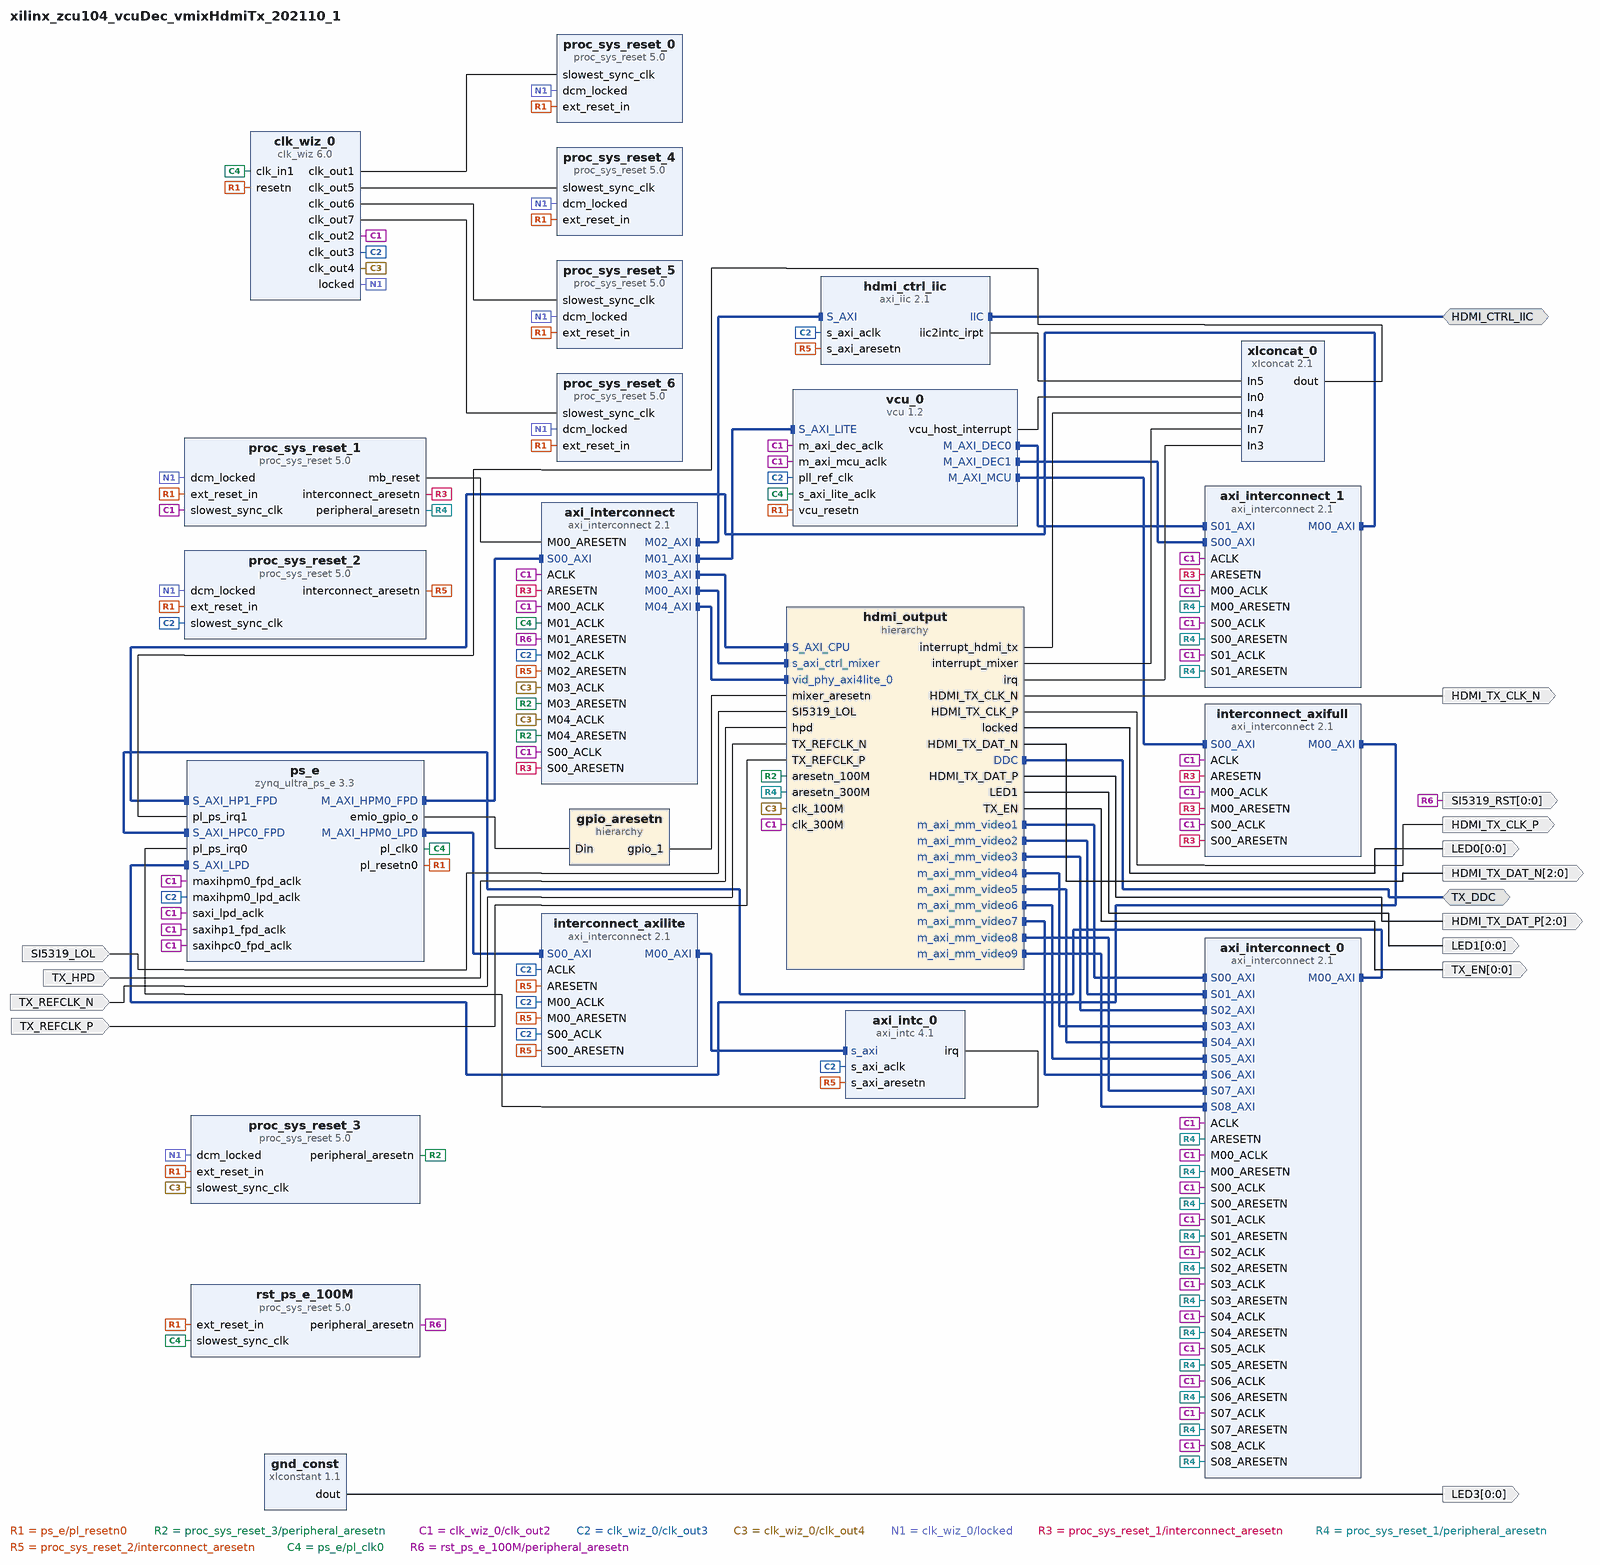
[diagram p0: block diagram of the top level]
# Vivado block design xilinx_zcu104_vcuDec_vmixHdmiTx_202110_1, xczu7ev-ffvc1156-2-e, Vivado 2021.1.1
create_bd_design xilinx_zcu104_vcuDec_vmixHdmiTx_202110_1

create_bd_intf_port -mode Master -vlnv xilinx.com:interface:iic_rtl:1.0 HDMI_CTRL_IIC
create_bd_intf_port -mode Master -vlnv xilinx.com:interface:iic_rtl:1.0 TX_DDC
create_bd_port -dir O HDMI_TX_CLK_N
create_bd_port -dir O HDMI_TX_CLK_P
create_bd_port -dir O -from 2 -to 0 HDMI_TX_DAT_N
create_bd_port -dir O -from 2 -to 0 HDMI_TX_DAT_P
create_bd_port -dir O -from 0 -to 0 LED0
create_bd_port -dir O -from 0 -to 0 LED1
create_bd_port -dir O -from 0 -to 0 LED3
create_bd_port -dir I SI5319_LOL
create_bd_port -dir O -from 0 -to 0 SI5319_RST
create_bd_port -dir O -from 0 -to 0 TX_EN
create_bd_port -dir I TX_HPD
create_bd_port -dir I TX_REFCLK_N
create_bd_port -dir I TX_REFCLK_P

create_bd_cell -type ip -vlnv xilinx.com:ip:axi_intc:4.1 axi_intc_0
set_property -dict {CONFIG.C_IRQ_CONNECTION 1 CONFIG.C_IRQ_IS_LEVEL 1} [get_bd_cells axi_intc_0]
create_bd_cell -type ip -vlnv xilinx.com:ip:axi_interconnect:2.1 axi_interconnect
set_property -dict {CONFIG.M03_HAS_REGSLICE 3 CONFIG.NUM_MI 5} [get_bd_cells axi_interconnect]
create_bd_cell -type ip -vlnv xilinx.com:ip:axi_interconnect:2.1 axi_interconnect_0
set_property -dict {CONFIG.NUM_MI 1 CONFIG.NUM_SI 9} [get_bd_cells axi_interconnect_0]
create_bd_cell -type ip -vlnv xilinx.com:ip:axi_interconnect:2.1 axi_interconnect_1
set_property -dict [list \
  CONFIG.M00_HAS_REGSLICE 1 \
  CONFIG.NUM_MI 1 \
  CONFIG.NUM_SI 2 \
  CONFIG.S00_HAS_DATA_FIFO 0 \
  CONFIG.S00_HAS_REGSLICE 1 \
  CONFIG.S01_HAS_DATA_FIFO 0 \
  CONFIG.S01_HAS_REGSLICE 1 \
  CONFIG.STRATEGY 0 \
] [get_bd_cells axi_interconnect_1]
create_bd_cell -type ip -vlnv xilinx.com:ip:clk_wiz:6.0 clk_wiz_0
set_property -dict [list \
  CONFIG.CLKIN1_JITTER_PS 100.01 \
  CONFIG.CLKOUT1_JITTER 107.567 \
  CONFIG.CLKOUT1_PHASE_ERROR 87.180 \
  CONFIG.CLKOUT1_REQUESTED_OUT_FREQ 150 \
  CONFIG.CLKOUT2_JITTER 94.862 \
  CONFIG.CLKOUT2_PHASE_ERROR 87.180 \
  CONFIG.CLKOUT2_REQUESTED_OUT_FREQ 300 \
  CONFIG.CLKOUT2_USED true \
  CONFIG.CLKOUT3_JITTER 144.570 \
  CONFIG.CLKOUT3_PHASE_ERROR 87.180 \
  CONFIG.CLKOUT3_REQUESTED_OUT_FREQ 33.33 \
  CONFIG.CLKOUT3_USED true \
  CONFIG.CLKOUT4_JITTER 115.831 \
  CONFIG.CLKOUT4_PHASE_ERROR 87.180 \
  CONFIG.CLKOUT4_REQUESTED_OUT_FREQ 100.000 \
  CONFIG.CLKOUT4_USED true \
  CONFIG.CLKOUT5_JITTER 102.086 \
  CONFIG.CLKOUT5_PHASE_ERROR 87.180 \
  CONFIG.CLKOUT5_REQUESTED_OUT_FREQ 200.000 \
  CONFIG.CLKOUT5_USED true \
  CONFIG.CLKOUT6_JITTER 90.074 \
  CONFIG.CLKOUT6_PHASE_ERROR 87.180 \
  CONFIG.CLKOUT6_REQUESTED_OUT_FREQ 400.000 \
  CONFIG.CLKOUT6_USED true \
  CONFIG.CLKOUT7_JITTER 83.768 \
  CONFIG.CLKOUT7_PHASE_ERROR 87.180 \
  CONFIG.CLKOUT7_REQUESTED_OUT_FREQ 600.000 \
  CONFIG.CLKOUT7_USED true \
  CONFIG.MMCM_CLKFBOUT_MULT_F 12.000 \
  CONFIG.MMCM_CLKIN1_PERIOD 10.000 \
  CONFIG.MMCM_CLKOUT0_DIVIDE_F 8.000 \
  CONFIG.MMCM_CLKOUT1_DIVIDE 4 \
  CONFIG.MMCM_CLKOUT2_DIVIDE 36 \
  CONFIG.MMCM_CLKOUT3_DIVIDE 12 \
  CONFIG.MMCM_CLKOUT4_DIVIDE 6 \
  CONFIG.MMCM_CLKOUT5_DIVIDE 3 \
  CONFIG.MMCM_CLKOUT6_DIVIDE 2 \
  CONFIG.MMCM_DIVCLK_DIVIDE 1 \
  CONFIG.NUM_OUT_CLKS 7 \
  CONFIG.RESET_PORT resetn \
  CONFIG.RESET_TYPE ACTIVE_LOW \
] [get_bd_cells clk_wiz_0]
create_bd_cell -type ip -vlnv xilinx.com:ip:xlconstant:1.1 gnd_const
set_property -dict {CONFIG.CONST_VAL 0} [get_bd_cells gnd_const]
create_bd_cell -type hier gpio_aresetn
create_bd_cell -type ip -vlnv xilinx.com:ip:axi_iic:2.1 hdmi_ctrl_iic
set_property -dict {CONFIG.IIC_BOARD_INTERFACE Custom CONFIG.USE_BOARD_FLOW true} [get_bd_cells hdmi_ctrl_iic]
create_bd_cell -type hier hdmi_output
create_bd_cell -type ip -vlnv xilinx.com:ip:axi_interconnect:2.1 interconnect_axifull
set_property -dict {CONFIG.NUM_MI 1 CONFIG.NUM_SI 1} [get_bd_cells interconnect_axifull]
create_bd_cell -type ip -vlnv xilinx.com:ip:axi_interconnect:2.1 interconnect_axilite
set_property -dict {CONFIG.NUM_MI 1} [get_bd_cells interconnect_axilite]
create_bd_cell -type ip -vlnv xilinx.com:ip:proc_sys_reset:5.0 proc_sys_reset_0
create_bd_cell -type ip -vlnv xilinx.com:ip:proc_sys_reset:5.0 proc_sys_reset_1
create_bd_cell -type ip -vlnv xilinx.com:ip:proc_sys_reset:5.0 proc_sys_reset_2
create_bd_cell -type ip -vlnv xilinx.com:ip:proc_sys_reset:5.0 proc_sys_reset_3
create_bd_cell -type ip -vlnv xilinx.com:ip:proc_sys_reset:5.0 proc_sys_reset_4
create_bd_cell -type ip -vlnv xilinx.com:ip:proc_sys_reset:5.0 proc_sys_reset_5
create_bd_cell -type ip -vlnv xilinx.com:ip:proc_sys_reset:5.0 proc_sys_reset_6
create_bd_cell -type ip -vlnv xilinx.com:ip:zynq_ultra_ps_e:3.3 ps_e
set_property -dict [list \
  CONFIG.CAN0_BOARD_INTERFACE custom \
  CONFIG.CAN1_BOARD_INTERFACE custom \
  CONFIG.CSU_BOARD_INTERFACE custom \
  CONFIG.DP_BOARD_INTERFACE custom \
  CONFIG.GEM0_BOARD_INTERFACE custom \
  CONFIG.GEM1_BOARD_INTERFACE custom \
  CONFIG.GEM2_BOARD_INTERFACE custom \
  CONFIG.GEM3_BOARD_INTERFACE custom \
  CONFIG.GPIO_BOARD_INTERFACE custom \
  CONFIG.IIC0_BOARD_INTERFACE custom \
  CONFIG.IIC1_BOARD_INTERFACE custom \
  CONFIG.NAND_BOARD_INTERFACE custom \
  CONFIG.PCIE_BOARD_INTERFACE custom \
  CONFIG.PJTAG_BOARD_INTERFACE custom \
  CONFIG.PMU_BOARD_INTERFACE custom \
  CONFIG.PSU_BANK_0_IO_STANDARD LVCMOS18 \
  CONFIG.PSU_BANK_1_IO_STANDARD LVCMOS18 \
  CONFIG.PSU_BANK_2_IO_STANDARD LVCMOS18 \
  CONFIG.PSU_BANK_3_IO_STANDARD LVCMOS33 \
  CONFIG.PSU_USB3__DUAL_CLOCK_ENABLE 1 \
  CONFIG.PSU__CAN1__PERIPHERAL__ENABLE 1 \
  CONFIG.PSU__CAN1__PERIPHERAL__IO {MIO 24 .. 25} \
  CONFIG.PSU__CRF_APB__ACPU_CTRL__FREQMHZ 1200 \
  CONFIG.PSU__CRF_APB__ACPU_CTRL__SRCSEL APLL \
  CONFIG.PSU__CRF_APB__APLL_CTRL__SRCSEL PSS_REF_CLK \
  CONFIG.PSU__CRF_APB__DBG_FPD_CTRL__FREQMHZ 250 \
  CONFIG.PSU__CRF_APB__DBG_FPD_CTRL__SRCSEL IOPLL \
  CONFIG.PSU__CRF_APB__DBG_TRACE_CTRL__FREQMHZ 250 \
  CONFIG.PSU__CRF_APB__DBG_TRACE_CTRL__SRCSEL IOPLL \
  CONFIG.PSU__CRF_APB__DBG_TSTMP_CTRL__FREQMHZ 250 \
  CONFIG.PSU__CRF_APB__DBG_TSTMP_CTRL__SRCSEL IOPLL \
  CONFIG.PSU__CRF_APB__DDR_CTRL__FREQMHZ 1067 \
  CONFIG.PSU__CRF_APB__DDR_CTRL__SRCSEL DPLL \
  CONFIG.PSU__CRF_APB__DPDMA_REF_CTRL__FREQMHZ 600 \
  CONFIG.PSU__CRF_APB__DPDMA_REF_CTRL__SRCSEL APLL \
  CONFIG.PSU__CRF_APB__DPLL_CTRL__SRCSEL PSS_REF_CLK \
  CONFIG.PSU__CRF_APB__DP_AUDIO_REF_CTRL__SRCSEL RPLL \
  CONFIG.PSU__CRF_APB__DP_STC_REF_CTRL__SRCSEL RPLL \
  CONFIG.PSU__CRF_APB__DP_VIDEO_REF_CTRL__SRCSEL VPLL \
  CONFIG.PSU__CRF_APB__GDMA_REF_CTRL__FREQMHZ 600 \
  CONFIG.PSU__CRF_APB__GDMA_REF_CTRL__SRCSEL APLL \
  CONFIG.PSU__CRF_APB__GPU_REF_CTRL__FREQMHZ 500 \
  CONFIG.PSU__CRF_APB__GPU_REF_CTRL__SRCSEL IOPLL \
  CONFIG.PSU__CRF_APB__TOPSW_LSBUS_CTRL__FREQMHZ 100 \
  CONFIG.PSU__CRF_APB__TOPSW_LSBUS_CTRL__SRCSEL IOPLL \
  CONFIG.PSU__CRF_APB__TOPSW_MAIN_CTRL__FREQMHZ 533.33 \
  CONFIG.PSU__CRF_APB__TOPSW_MAIN_CTRL__SRCSEL DPLL \
  CONFIG.PSU__CRF_APB__VPLL_CTRL__SRCSEL PSS_REF_CLK \
  CONFIG.PSU__CRL_APB__ADMA_REF_CTRL__FREQMHZ 500 \
  CONFIG.PSU__CRL_APB__ADMA_REF_CTRL__SRCSEL IOPLL \
  CONFIG.PSU__CRL_APB__CAN1_REF_CTRL__FREQMHZ 100 \
  CONFIG.PSU__CRL_APB__CAN1_REF_CTRL__SRCSEL IOPLL \
  CONFIG.PSU__CRL_APB__CPU_R5_CTRL__FREQMHZ 500 \
  CONFIG.PSU__CRL_APB__CPU_R5_CTRL__SRCSEL IOPLL \
  CONFIG.PSU__CRL_APB__DBG_LPD_CTRL__FREQMHZ 250 \
  CONFIG.PSU__CRL_APB__DBG_LPD_CTRL__SRCSEL IOPLL \
  CONFIG.PSU__CRL_APB__GEM3_REF_CTRL__FREQMHZ 125 \
  CONFIG.PSU__CRL_APB__GEM3_REF_CTRL__SRCSEL IOPLL \
  CONFIG.PSU__CRL_APB__I2C0_REF_CTRL__FREQMHZ 100 \
  CONFIG.PSU__CRL_APB__I2C0_REF_CTRL__SRCSEL IOPLL \
  CONFIG.PSU__CRL_APB__I2C1_REF_CTRL__FREQMHZ 100 \
  CONFIG.PSU__CRL_APB__I2C1_REF_CTRL__SRCSEL IOPLL \
  CONFIG.PSU__CRL_APB__IOPLL_CTRL__SRCSEL PSS_REF_CLK \
  CONFIG.PSU__CRL_APB__IOU_SWITCH_CTRL__FREQMHZ 250 \
  CONFIG.PSU__CRL_APB__IOU_SWITCH_CTRL__SRCSEL IOPLL \
  CONFIG.PSU__CRL_APB__LPD_LSBUS_CTRL__FREQMHZ 100 \
  CONFIG.PSU__CRL_APB__LPD_LSBUS_CTRL__SRCSEL IOPLL \
  CONFIG.PSU__CRL_APB__LPD_SWITCH_CTRL__FREQMHZ 500 \
  CONFIG.PSU__CRL_APB__LPD_SWITCH_CTRL__SRCSEL IOPLL \
  CONFIG.PSU__CRL_APB__PCAP_CTRL__FREQMHZ 200 \
  CONFIG.PSU__CRL_APB__PCAP_CTRL__SRCSEL IOPLL \
  CONFIG.PSU__CRL_APB__PL0_REF_CTRL__FREQMHZ 100 \
  CONFIG.PSU__CRL_APB__PL0_REF_CTRL__SRCSEL IOPLL \
  CONFIG.PSU__CRL_APB__QSPI_REF_CTRL__FREQMHZ 125 \
  CONFIG.PSU__CRL_APB__QSPI_REF_CTRL__SRCSEL IOPLL \
  CONFIG.PSU__CRL_APB__RPLL_CTRL__SRCSEL PSS_REF_CLK \
  CONFIG.PSU__CRL_APB__SDIO1_REF_CTRL__FREQMHZ 200 \
  CONFIG.PSU__CRL_APB__SDIO1_REF_CTRL__SRCSEL IOPLL \
  CONFIG.PSU__CRL_APB__TIMESTAMP_REF_CTRL__FREQMHZ 100 \
  CONFIG.PSU__CRL_APB__TIMESTAMP_REF_CTRL__SRCSEL IOPLL \
  CONFIG.PSU__CRL_APB__UART0_REF_CTRL__FREQMHZ 100 \
  CONFIG.PSU__CRL_APB__UART0_REF_CTRL__SRCSEL IOPLL \
  CONFIG.PSU__CRL_APB__UART1_REF_CTRL__FREQMHZ 100 \
  CONFIG.PSU__CRL_APB__UART1_REF_CTRL__SRCSEL IOPLL \
  CONFIG.PSU__CRL_APB__USB0_BUS_REF_CTRL__FREQMHZ 250 \
  CONFIG.PSU__CRL_APB__USB0_BUS_REF_CTRL__SRCSEL IOPLL \
  CONFIG.PSU__CRL_APB__USB3_DUAL_REF_CTRL__FREQMHZ 20 \
  CONFIG.PSU__CRL_APB__USB3_DUAL_REF_CTRL__SRCSEL IOPLL \
  CONFIG.PSU__CRL_APB__USB3__ENABLE 1 \
  CONFIG.PSU__CSUPMU__PERIPHERAL__VALID 0 \
  CONFIG.PSU__DDRC__BUS_WIDTH {64 Bit} \
  CONFIG.PSU__DDRC__COMPONENTS Components \
  CONFIG.PSU__DDRC__DEVICE_CAPACITY {4096 MBits} \
  CONFIG.PSU__DDRC__DRAM_WIDTH {16 Bits} \
  CONFIG.PSU__DDRC__ECC Disabled \
  CONFIG.PSU__DDRC__MEMORY_TYPE {DDR 4} \
  CONFIG.PSU__DDRC__SPEED_BIN DDR4_2133P \
  CONFIG.PSU__DDR_HIGH_ADDRESS_GUI_ENABLE 0 \
  CONFIG.PSU__DDR__INTERFACE__FREQMHZ 533.500 \
  CONFIG.PSU__DEVICE_TYPE EV \
  CONFIG.PSU__DISPLAYPORT__LANE0__ENABLE 1 \
  CONFIG.PSU__DISPLAYPORT__LANE0__IO {GT Lane1} \
  CONFIG.PSU__DISPLAYPORT__LANE1__ENABLE 1 \
  CONFIG.PSU__DISPLAYPORT__LANE1__IO {GT Lane0} \
  CONFIG.PSU__DISPLAYPORT__PERIPHERAL__ENABLE 1 \
  CONFIG.PSU__DLL__ISUSED 1 \
  CONFIG.PSU__DPAUX__PERIPHERAL__ENABLE 1 \
  CONFIG.PSU__DPAUX__PERIPHERAL__IO {MIO 27 .. 30} \
  CONFIG.PSU__DP__LANE_SEL {Dual Lower} \
  CONFIG.PSU__DP__REF_CLK_FREQ 27 \
  CONFIG.PSU__DP__REF_CLK_SEL {Ref Clk3} \
  CONFIG.PSU__ENET3__FIFO__ENABLE 0 \
  CONFIG.PSU__ENET3__GRP_MDIO__ENABLE 1 \
  CONFIG.PSU__ENET3__GRP_MDIO__IO {MIO 76 .. 77} \
  CONFIG.PSU__ENET3__PERIPHERAL__ENABLE 1 \
  CONFIG.PSU__ENET3__PERIPHERAL__IO {MIO 64 .. 75} \
  CONFIG.PSU__ENET3__PTP__ENABLE 0 \
  CONFIG.PSU__ENET3__TSU__ENABLE 0 \
  CONFIG.PSU__FPGA_PL0_ENABLE 1 \
  CONFIG.PSU__GEM3_COHERENCY 0 \
  CONFIG.PSU__GEM3_ROUTE_THROUGH_FPD 0 \
  CONFIG.PSU__GEM__TSU__ENABLE 0 \
  CONFIG.PSU__GPIO0_MIO__IO {MIO 0 .. 25} \
  CONFIG.PSU__GPIO0_MIO__PERIPHERAL__ENABLE 1 \
  CONFIG.PSU__GPIO1_MIO__IO {MIO 26 .. 51} \
  CONFIG.PSU__GPIO1_MIO__PERIPHERAL__ENABLE 1 \
  CONFIG.PSU__GPIO_EMIO_WIDTH 95 \
  CONFIG.PSU__GPIO_EMIO__PERIPHERAL__ENABLE 1 \
  CONFIG.PSU__GPIO_EMIO__PERIPHERAL__IO 95 \
  CONFIG.PSU__GT__LINK_SPEED HBR \
  CONFIG.PSU__GT__PRE_EMPH_LVL_4 0 \
  CONFIG.PSU__GT__VLT_SWNG_LVL_4 0 \
  CONFIG.PSU__I2C0__PERIPHERAL__ENABLE 0 \
  CONFIG.PSU__I2C1__PERIPHERAL__ENABLE 1 \
  CONFIG.PSU__I2C1__PERIPHERAL__IO {MIO 16 .. 17} \
  CONFIG.PSU__IOU_SLCR__IOU_TTC_APB_CLK__TTC0_SEL APB \
  CONFIG.PSU__IOU_SLCR__IOU_TTC_APB_CLK__TTC1_SEL APB \
  CONFIG.PSU__IOU_SLCR__IOU_TTC_APB_CLK__TTC2_SEL APB \
  CONFIG.PSU__IOU_SLCR__IOU_TTC_APB_CLK__TTC3_SEL APB \
  CONFIG.PSU__LPD_SLCR__CSUPMU__FREQMHZ 100 \
  CONFIG.PSU__MAXIGP0__DATA_WIDTH 128 \
  CONFIG.PSU__OVERRIDE_HPX_QOS 0 \
  CONFIG.PSU__OVERRIDE__BASIC_CLOCK 0 \
  CONFIG.PSU__PMU__PERIPHERAL__ENABLE 0 \
  CONFIG.PSU__PRESET_APPLIED 1 \
  CONFIG.PSU__PSS_REF_CLK__FREQMHZ 33.333333 \
  CONFIG.PSU__QSPI_COHERENCY 0 \
  CONFIG.PSU__QSPI_ROUTE_THROUGH_FPD 0 \
  CONFIG.PSU__QSPI__GRP_FBCLK__ENABLE 1 \
  CONFIG.PSU__QSPI__GRP_FBCLK__IO {MIO 6} \
  CONFIG.PSU__QSPI__PERIPHERAL__DATA_MODE x4 \
  CONFIG.PSU__QSPI__PERIPHERAL__ENABLE 1 \
  CONFIG.PSU__QSPI__PERIPHERAL__IO {MIO 0 .. 5} \
  CONFIG.PSU__QSPI__PERIPHERAL__MODE Single \
  CONFIG.PSU__SATA__LANE1__IO {GT Lane3} \
  CONFIG.PSU__SATA__PERIPHERAL__ENABLE 1 \
  CONFIG.PSU__SATA__REF_CLK_FREQ 125 \
  CONFIG.PSU__SATA__REF_CLK_SEL {Ref Clk1} \
  CONFIG.PSU__SAXIGP6__DATA_WIDTH 32 \
  CONFIG.PSU__SD1_COHERENCY 0 \
  CONFIG.PSU__SD1_ROUTE_THROUGH_FPD 0 \
  CONFIG.PSU__SD1__DATA_TRANSFER_MODE 8Bit \
  CONFIG.PSU__SD1__GRP_CD__ENABLE 1 \
  CONFIG.PSU__SD1__GRP_CD__IO {MIO 45} \
  CONFIG.PSU__SD1__GRP_POW__ENABLE 0 \
  CONFIG.PSU__SD1__GRP_WP__ENABLE 0 \
  CONFIG.PSU__SD1__PERIPHERAL__ENABLE 1 \
  CONFIG.PSU__SD1__PERIPHERAL__IO {MIO 39 .. 51} \
  CONFIG.PSU__SD1__SLOT_TYPE {SD 3.0} \
  CONFIG.PSU__SWDT0__CLOCK__ENABLE 0 \
  CONFIG.PSU__SWDT0__PERIPHERAL__ENABLE 1 \
  CONFIG.PSU__SWDT0__RESET__ENABLE 0 \
  CONFIG.PSU__SWDT1__CLOCK__ENABLE 0 \
  CONFIG.PSU__SWDT1__PERIPHERAL__ENABLE 1 \
  CONFIG.PSU__SWDT1__RESET__ENABLE 0 \
  CONFIG.PSU__TSU__BUFG_PORT_PAIR 0 \
  CONFIG.PSU__TTC0__CLOCK__ENABLE 0 \
  CONFIG.PSU__TTC0__PERIPHERAL__ENABLE 1 \
  CONFIG.PSU__TTC0__WAVEOUT__ENABLE 0 \
  CONFIG.PSU__TTC1__CLOCK__ENABLE 0 \
  CONFIG.PSU__TTC1__PERIPHERAL__ENABLE 1 \
  CONFIG.PSU__TTC1__WAVEOUT__ENABLE 0 \
  CONFIG.PSU__TTC2__CLOCK__ENABLE 0 \
  CONFIG.PSU__TTC2__PERIPHERAL__ENABLE 1 \
  CONFIG.PSU__TTC2__WAVEOUT__ENABLE 0 \
  CONFIG.PSU__TTC3__CLOCK__ENABLE 0 \
  CONFIG.PSU__TTC3__PERIPHERAL__ENABLE 1 \
  CONFIG.PSU__TTC3__WAVEOUT__ENABLE 0 \
  CONFIG.PSU__UART0__BAUD_RATE 115200 \
  CONFIG.PSU__UART0__MODEM__ENABLE 0 \
  CONFIG.PSU__UART0__PERIPHERAL__ENABLE 1 \
  CONFIG.PSU__UART0__PERIPHERAL__IO {MIO 18 .. 19} \
  CONFIG.PSU__UART1__BAUD_RATE 115200 \
  CONFIG.PSU__UART1__MODEM__ENABLE 0 \
  CONFIG.PSU__UART1__PERIPHERAL__ENABLE 1 \
  CONFIG.PSU__UART1__PERIPHERAL__IO {MIO 20 .. 21} \
  CONFIG.PSU__USB0_COHERENCY 0 \
  CONFIG.PSU__USB0__PERIPHERAL__ENABLE 1 \
  CONFIG.PSU__USB0__PERIPHERAL__IO {MIO 52 .. 63} \
  CONFIG.PSU__USB0__REF_CLK_FREQ 26 \
  CONFIG.PSU__USB0__REF_CLK_SEL {Ref Clk2} \
  CONFIG.PSU__USB2_0__EMIO__ENABLE 0 \
  CONFIG.PSU__USB3_0__EMIO__ENABLE 0 \
  CONFIG.PSU__USB3_0__PERIPHERAL__ENABLE 1 \
  CONFIG.PSU__USB3_0__PERIPHERAL__IO {GT Lane2} \
  CONFIG.PSU__USB__RESET__MODE {Boot Pin} \
  CONFIG.PSU__USB__RESET__POLARITY {Active Low} \
  CONFIG.PSU__USE__IRQ0 1 \
  CONFIG.PSU__USE__IRQ1 1 \
  CONFIG.PSU__USE__M_AXI_GP0 1 \
  CONFIG.PSU__USE__M_AXI_GP1 0 \
  CONFIG.PSU__USE__M_AXI_GP2 1 \
  CONFIG.PSU__USE__S_AXI_GP0 1 \
  CONFIG.PSU__USE__S_AXI_GP3 1 \
  CONFIG.PSU__USE__S_AXI_GP6 1 \
  CONFIG.QSPI_BOARD_INTERFACE custom \
  CONFIG.SATA_BOARD_INTERFACE custom \
  CONFIG.SD0_BOARD_INTERFACE custom \
  CONFIG.SD1_BOARD_INTERFACE custom \
  CONFIG.SPI0_BOARD_INTERFACE custom \
  CONFIG.SPI1_BOARD_INTERFACE custom \
  CONFIG.SUBPRESET1 Custom \
  CONFIG.SUBPRESET2 Custom \
  CONFIG.SWDT0_BOARD_INTERFACE custom \
  CONFIG.SWDT1_BOARD_INTERFACE custom \
  CONFIG.TRACE_BOARD_INTERFACE custom \
  CONFIG.TTC0_BOARD_INTERFACE custom \
  CONFIG.TTC1_BOARD_INTERFACE custom \
  CONFIG.TTC2_BOARD_INTERFACE custom \
  CONFIG.TTC3_BOARD_INTERFACE custom \
  CONFIG.UART0_BOARD_INTERFACE custom \
  CONFIG.UART1_BOARD_INTERFACE custom \
  CONFIG.USB0_BOARD_INTERFACE custom \
  CONFIG.USB1_BOARD_INTERFACE custom \
] [get_bd_cells ps_e]
# 746 more settings of ps_e are not shown: defaults, MIO pin electricals, DDR timing, and values the tool derives
create_bd_cell -type ip -vlnv xilinx.com:ip:proc_sys_reset:5.0 rst_ps_e_100M
create_bd_cell -type ip -vlnv xilinx.com:ip:vcu:1.2 vcu_0
set_property -dict [list \
  CONFIG.DEC_CODING_TYPE 1 \
  CONFIG.DEC_COLOR_DEPTH 0 \
  CONFIG.DEC_COLOR_FORMAT 0 \
  CONFIG.ENABLE_ENCODER false \
  CONFIG.ENC_BUFFER_SIZE_ACTUAL 0 \
  CONFIG.ENC_MEM_URAM_USED 0 \
  CONFIG.TABLE_NO 0 \
] [get_bd_cells vcu_0]
create_bd_cell -type ip -vlnv xilinx.com:ip:xlconcat:2.1 xlconcat_0
set_property -dict {CONFIG.NUM_PORTS 8} [get_bd_cells xlconcat_0]

# ---- hierarchy /gpio_aresetn ----
current_bd_instance /gpio_aresetn
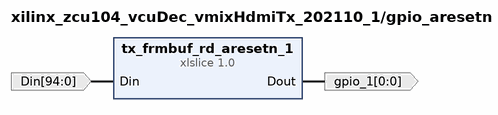
[diagram p1: block diagram inside /gpio_aresetn]
create_bd_pin -dir I -from 94 -to 0 Din
create_bd_pin -dir O -from 0 -to 0 gpio_1

create_bd_cell -type ip -vlnv xilinx.com:ip:xlslice:1.0 tx_frmbuf_rd_aresetn_1
set_property -dict [list \
  CONFIG.DIN_FROM 0 \
  CONFIG.DIN_TO 0 \
  CONFIG.DIN_WIDTH 95 \
  CONFIG.DOUT_WIDTH 1 \
] [get_bd_cells tx_frmbuf_rd_aresetn_1]

# ---- hierarchy /hdmi_output ----
current_bd_instance /hdmi_output
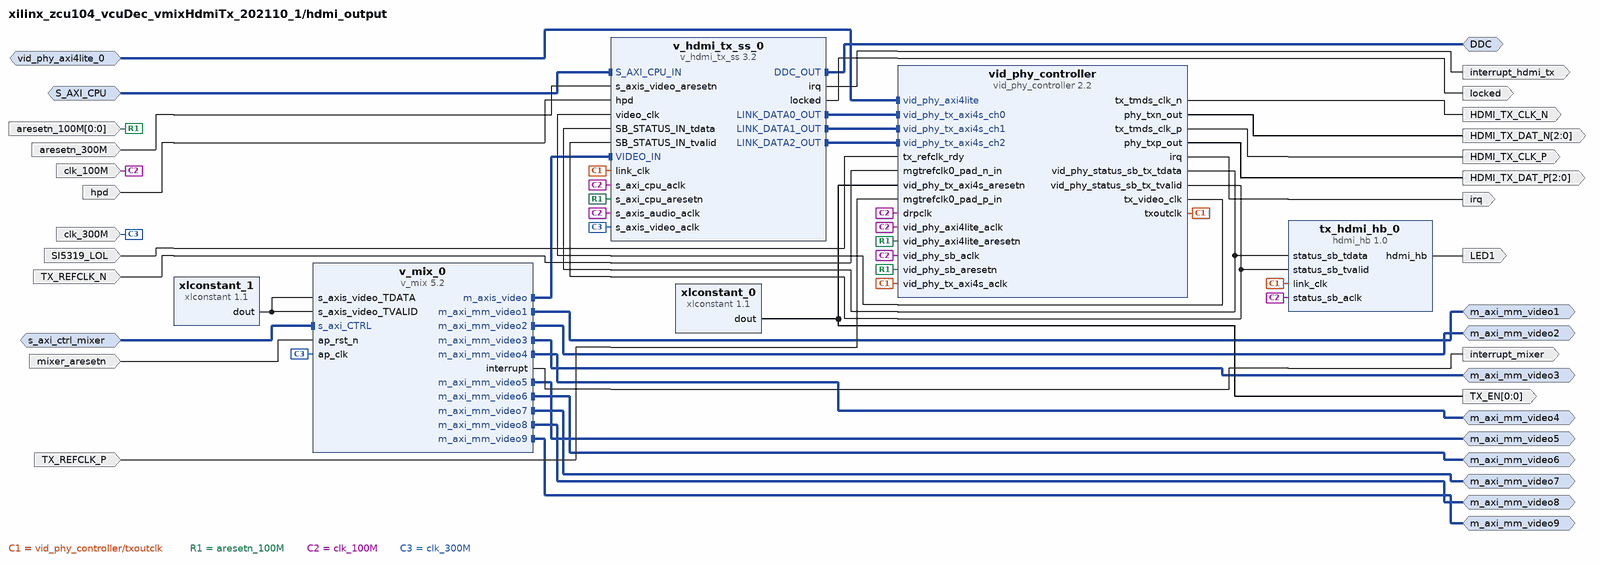
[diagram p2: block diagram inside /hdmi_output]
create_bd_intf_pin -mode Master -vlnv xilinx.com:interface:iic_rtl:1.0 DDC
create_bd_intf_pin -mode Slave -vlnv xilinx.com:interface:aximm_rtl:1.0 S_AXI_CPU
create_bd_intf_pin -mode Master -vlnv xilinx.com:interface:aximm_rtl:1.0 m_axi_mm_video1
create_bd_intf_pin -mode Master -vlnv xilinx.com:interface:aximm_rtl:1.0 m_axi_mm_video2
create_bd_intf_pin -mode Master -vlnv xilinx.com:interface:aximm_rtl:1.0 m_axi_mm_video3
create_bd_intf_pin -mode Master -vlnv xilinx.com:interface:aximm_rtl:1.0 m_axi_mm_video4
create_bd_intf_pin -mode Master -vlnv xilinx.com:interface:aximm_rtl:1.0 m_axi_mm_video5
create_bd_intf_pin -mode Master -vlnv xilinx.com:interface:aximm_rtl:1.0 m_axi_mm_video6
create_bd_intf_pin -mode Master -vlnv xilinx.com:interface:aximm_rtl:1.0 m_axi_mm_video7
create_bd_intf_pin -mode Master -vlnv xilinx.com:interface:aximm_rtl:1.0 m_axi_mm_video8
create_bd_intf_pin -mode Master -vlnv xilinx.com:interface:aximm_rtl:1.0 m_axi_mm_video9
create_bd_intf_pin -mode Slave -vlnv xilinx.com:interface:aximm_rtl:1.0 s_axi_ctrl_mixer
create_bd_intf_pin -mode Slave -vlnv xilinx.com:interface:aximm_rtl:1.0 vid_phy_axi4lite_0
create_bd_pin -dir O -type clk HDMI_TX_CLK_N
create_bd_pin -dir O -type clk HDMI_TX_CLK_P
create_bd_pin -dir O -from 2 -to 0 HDMI_TX_DAT_N
create_bd_pin -dir O -from 2 -to 0 HDMI_TX_DAT_P
create_bd_pin -dir O LED1
create_bd_pin -dir I SI5319_LOL
create_bd_pin -dir O -from 0 -to 0 TX_EN
create_bd_pin -dir I -type clk TX_REFCLK_N
create_bd_pin -dir I -type clk TX_REFCLK_P
create_bd_pin -dir I -from 0 -to 0 -type rst aresetn_100M
create_bd_pin -dir I -type rst aresetn_300M
create_bd_pin -dir I -type clk clk_100M
create_bd_pin -dir I -type clk clk_300M
create_bd_pin -dir I hpd
create_bd_pin -dir O -type intr interrupt_hdmi_tx
create_bd_pin -dir O -type intr interrupt_mixer
create_bd_pin -dir O -type intr irq
create_bd_pin -dir O locked
create_bd_pin -dir I -type rst mixer_aresetn

create_bd_cell -type ip -vlnv xilinx.com:user:hdmi_hb:1.0 tx_hdmi_hb_0
create_bd_cell -type ip -vlnv xilinx.com:ip:v_hdmi_tx_ss:3.2 v_hdmi_tx_ss_0
set_property -dict [list \
  CONFIG.C_HDMI_FAST_SWITCH true \
  CONFIG.C_INCLUDE_YUV420_SUP true \
  CONFIG.C_INPUT_PIXELS_PER_CLOCK 2 \
  CONFIG.C_MAX_BITS_PER_COMPONENT 8 \
  CONFIG.C_VID_INTERFACE 0 \
] [get_bd_cells v_hdmi_tx_ss_0]
create_bd_cell -type ip -vlnv xilinx.com:ip:v_mix:5.2 v_mix_0
set_property -dict [list \
  CONFIG.AXIMM_DATA_WIDTH 128 \
  CONFIG.C_M_AXI_MM_VIDEO1_DATA_WIDTH 128 \
  CONFIG.C_M_AXI_MM_VIDEO2_DATA_WIDTH 128 \
  CONFIG.C_M_AXI_MM_VIDEO3_DATA_WIDTH 128 \
  CONFIG.C_M_AXI_MM_VIDEO4_DATA_WIDTH 128 \
  CONFIG.C_M_AXI_MM_VIDEO5_DATA_WIDTH 128 \
  CONFIG.C_M_AXI_MM_VIDEO6_DATA_WIDTH 128 \
  CONFIG.C_M_AXI_MM_VIDEO7_DATA_WIDTH 128 \
  CONFIG.C_M_AXI_MM_VIDEO8_DATA_WIDTH 128 \
  CONFIG.C_M_AXI_MM_VIDEO9_DATA_WIDTH 128 \
  CONFIG.LAYER1_VIDEO_FORMAT 19 \
  CONFIG.LAYER2_VIDEO_FORMAT 19 \
  CONFIG.LAYER3_VIDEO_FORMAT 19 \
  CONFIG.LAYER4_VIDEO_FORMAT 19 \
  CONFIG.LAYER5_VIDEO_FORMAT 19 \
  CONFIG.LAYER6_VIDEO_FORMAT 19 \
  CONFIG.LAYER7_VIDEO_FORMAT 19 \
  CONFIG.LAYER8_VIDEO_FORMAT 19 \
  CONFIG.LAYER9_VIDEO_FORMAT 19 \
  CONFIG.NR_LAYERS 10 \
  CONFIG.SAMPLES_PER_CLOCK 2 \
] [get_bd_cells v_mix_0]
create_bd_cell -type ip -vlnv xilinx.com:ip:vid_phy_controller:2.2 vid_phy_controller
set_property -dict [list \
  CONFIG.CHANNEL_ENABLE {X0Y16 X0Y17 X0Y18} \
  CONFIG.CHANNEL_SITE X0Y16 \
  CONFIG.C_FOR_UPGRADE_ARCHITECTURE placeholder \
  CONFIG.C_FOR_UPGRADE_DEVICE placeholder \
  CONFIG.C_FOR_UPGRADE_MAXOPTVOL 0.00 \
  CONFIG.C_FOR_UPGRADE_PACKAGE placeholder \
  CONFIG.C_FOR_UPGRADE_PART placeholder \
  CONFIG.C_FOR_UPGRADE_REFVOL 0.00 \
  CONFIG.C_FOR_UPGRADE_SPEEDGRADE 0 \
  CONFIG.C_INPUT_PIXELS_PER_CLOCK 2 \
  CONFIG.C_INT_HDMI_VER_CMPTBLE 3 \
  CONFIG.C_RX_PLL_SELECTION 0 \
  CONFIG.C_RX_REFCLK_SEL 1 \
  CONFIG.C_Rx_Protocol None \
  CONFIG.C_TX_PLL_SELECTION 6 \
  CONFIG.C_TX_REFCLK_SEL 0 \
  CONFIG.C_Tx_Protocol HDMI \
  CONFIG.C_Txrefclk_Rdy_Invert true \
  CONFIG.C_Use_Oddr_for_Tmds_Clkout true \
  CONFIG.C_vid_phy_rx_axi4s_ch_INT_TDATA_WIDTH 20 \
  CONFIG.C_vid_phy_rx_axi4s_ch_TDATA_WIDTH 20 \
  CONFIG.C_vid_phy_rx_axi4s_ch_TUSER_WIDTH 1 \
  CONFIG.C_vid_phy_tx_axi4s_ch_INT_TDATA_WIDTH 20 \
  CONFIG.C_vid_phy_tx_axi4s_ch_TDATA_WIDTH 20 \
  CONFIG.C_vid_phy_tx_axi4s_ch_TUSER_WIDTH 1 \
  CONFIG.Rx_GT_Line_Rate 5.94 \
  CONFIG.Rx_GT_Ref_Clock_Freq 297 \
  CONFIG.Tx_GT_Line_Rate 5.94 \
  CONFIG.Tx_GT_Ref_Clock_Freq 297 \
] [get_bd_cells vid_phy_controller]
create_bd_cell -type ip -vlnv xilinx.com:ip:xlconstant:1.1 xlconstant_0
create_bd_cell -type ip -vlnv xilinx.com:ip:xlconstant:1.1 xlconstant_1
set_property -dict {CONFIG.CONST_VAL 0 CONFIG.CONST_WIDTH 48} [get_bd_cells xlconstant_1]

# ---- connections ----

current_bd_instance /gpio_aresetn
connect_bd_net -net frmbuf_rd_rst_gpio_Dout [get_bd_pins tx_frmbuf_rd_aresetn_1/Dout] [get_bd_pins gpio_1]
connect_bd_net -net zynq_ultra_ps_e_0_emio_gpio_o [get_bd_pins Din] [get_bd_pins tx_frmbuf_rd_aresetn_1/Din]

current_bd_instance /hdmi_output
connect_bd_intf_net [get_bd_intf_pins vid_phy_axi4lite_0] [get_bd_intf_pins vid_phy_controller/vid_phy_axi4lite]
connect_bd_intf_net [get_bd_intf_pins m_axi_mm_video1] [get_bd_intf_pins v_mix_0/m_axi_mm_video1]
connect_bd_intf_net [get_bd_intf_pins m_axi_mm_video2] [get_bd_intf_pins v_mix_0/m_axi_mm_video2]
connect_bd_intf_net [get_bd_intf_pins m_axi_mm_video3] [get_bd_intf_pins v_mix_0/m_axi_mm_video3]
connect_bd_intf_net [get_bd_intf_pins m_axi_mm_video4] [get_bd_intf_pins v_mix_0/m_axi_mm_video4]
connect_bd_intf_net [get_bd_intf_pins m_axi_mm_video5] [get_bd_intf_pins v_mix_0/m_axi_mm_video5]
connect_bd_intf_net [get_bd_intf_pins m_axi_mm_video6] [get_bd_intf_pins v_mix_0/m_axi_mm_video6]
connect_bd_intf_net [get_bd_intf_pins m_axi_mm_video7] [get_bd_intf_pins v_mix_0/m_axi_mm_video7]
connect_bd_intf_net [get_bd_intf_pins m_axi_mm_video8] [get_bd_intf_pins v_mix_0/m_axi_mm_video8]
connect_bd_intf_net [get_bd_intf_pins m_axi_mm_video9] [get_bd_intf_pins v_mix_0/m_axi_mm_video9]
connect_bd_intf_net [get_bd_intf_pins DDC] [get_bd_intf_pins v_hdmi_tx_ss_0/DDC_OUT]
connect_bd_intf_net [get_bd_intf_pins S_AXI_CPU] [get_bd_intf_pins v_hdmi_tx_ss_0/S_AXI_CPU_IN]
connect_bd_intf_net -intf_net s_axi_ctrl_frm_rd_1 [get_bd_intf_pins s_axi_ctrl_mixer] [get_bd_intf_pins v_mix_0/s_axi_CTRL]
connect_bd_intf_net [get_bd_intf_pins v_hdmi_tx_ss_0/LINK_DATA0_OUT] [get_bd_intf_pins vid_phy_controller/vid_phy_tx_axi4s_ch0]
connect_bd_intf_net [get_bd_intf_pins v_hdmi_tx_ss_0/LINK_DATA1_OUT] [get_bd_intf_pins vid_phy_controller/vid_phy_tx_axi4s_ch1]
connect_bd_intf_net [get_bd_intf_pins v_hdmi_tx_ss_0/LINK_DATA2_OUT] [get_bd_intf_pins vid_phy_controller/vid_phy_tx_axi4s_ch2]
connect_bd_intf_net [get_bd_intf_pins v_hdmi_tx_ss_0/VIDEO_IN] [get_bd_intf_pins v_mix_0/m_axis_video]
connect_bd_net [get_bd_pins vid_phy_controller/txoutclk] \
  [get_bd_pins tx_hdmi_hb_0/link_clk] [get_bd_pins v_hdmi_tx_ss_0/link_clk] \
  [get_bd_pins vid_phy_controller/vid_phy_tx_axi4s_aclk]
connect_bd_net [get_bd_pins SI5319_LOL] [get_bd_pins vid_phy_controller/tx_refclk_rdy]
connect_bd_net [get_bd_pins TX_REFCLK_N] [get_bd_pins vid_phy_controller/mgtrefclk0_pad_n_in]
connect_bd_net [get_bd_pins TX_REFCLK_P] [get_bd_pins vid_phy_controller/mgtrefclk0_pad_p_in]
connect_bd_net [get_bd_pins aresetn_100M] \
  [get_bd_pins v_hdmi_tx_ss_0/s_axi_cpu_aresetn] [get_bd_pins vid_phy_controller/vid_phy_axi4lite_aresetn] \
  [get_bd_pins vid_phy_controller/vid_phy_sb_aresetn]
connect_bd_net [get_bd_pins aresetn_300M] [get_bd_pins v_hdmi_tx_ss_0/s_axis_video_aresetn]
connect_bd_net [get_bd_pins clk_100M] \
  [get_bd_pins tx_hdmi_hb_0/status_sb_aclk] [get_bd_pins v_hdmi_tx_ss_0/s_axi_cpu_aclk] \
  [get_bd_pins v_hdmi_tx_ss_0/s_axis_audio_aclk] [get_bd_pins vid_phy_controller/drpclk] \
  [get_bd_pins vid_phy_controller/vid_phy_axi4lite_aclk] [get_bd_pins vid_phy_controller/vid_phy_sb_aclk]
connect_bd_net [get_bd_pins clk_300M] [get_bd_pins v_hdmi_tx_ss_0/s_axis_video_aclk] [get_bd_pins v_mix_0/ap_clk]
connect_bd_net -net frmbuf_aresetn [get_bd_pins mixer_aresetn] [get_bd_pins v_mix_0/ap_rst_n]
connect_bd_net [get_bd_pins hpd] [get_bd_pins v_hdmi_tx_ss_0/hpd]
connect_bd_net [get_bd_pins tx_hdmi_hb_0/hdmi_hb] [get_bd_pins LED1]
connect_bd_net [get_bd_pins v_hdmi_tx_ss_0/irq] [get_bd_pins interrupt_hdmi_tx]
connect_bd_net [get_bd_pins v_hdmi_tx_ss_0/locked] [get_bd_pins locked]
connect_bd_net [get_bd_pins v_mix_0/interrupt] [get_bd_pins interrupt_mixer]
connect_bd_net [get_bd_pins vid_phy_controller/irq] [get_bd_pins irq]
connect_bd_net [get_bd_pins vid_phy_controller/phy_txn_out] [get_bd_pins HDMI_TX_DAT_N]
connect_bd_net [get_bd_pins vid_phy_controller/phy_txp_out] [get_bd_pins HDMI_TX_DAT_P]
connect_bd_net [get_bd_pins vid_phy_controller/tx_tmds_clk_n] [get_bd_pins HDMI_TX_CLK_N]
connect_bd_net [get_bd_pins vid_phy_controller/tx_tmds_clk_p] [get_bd_pins HDMI_TX_CLK_P]
connect_bd_net [get_bd_pins vid_phy_controller/tx_video_clk] [get_bd_pins v_hdmi_tx_ss_0/video_clk]
connect_bd_net [get_bd_pins vid_phy_controller/vid_phy_status_sb_tx_tdata] \
  [get_bd_pins tx_hdmi_hb_0/status_sb_tdata] [get_bd_pins v_hdmi_tx_ss_0/SB_STATUS_IN_tdata]
connect_bd_net [get_bd_pins vid_phy_controller/vid_phy_status_sb_tx_tvalid] \
  [get_bd_pins tx_hdmi_hb_0/status_sb_tvalid] [get_bd_pins v_hdmi_tx_ss_0/SB_STATUS_IN_tvalid]
connect_bd_net [get_bd_pins xlconstant_0/dout] [get_bd_pins TX_EN] [get_bd_pins vid_phy_controller/vid_phy_tx_axi4s_aresetn]
connect_bd_net [get_bd_pins xlconstant_1/dout] [get_bd_pins v_mix_0/s_axis_video_TDATA] [get_bd_pins v_mix_0/s_axis_video_TVALID]

current_bd_instance /
connect_bd_intf_net [get_bd_intf_ports HDMI_CTRL_IIC] [get_bd_intf_pins hdmi_ctrl_iic/IIC]
connect_bd_intf_net [get_bd_intf_pins axi_interconnect_0/S00_AXI] [get_bd_intf_pins hdmi_output/m_axi_mm_video1]
connect_bd_intf_net [get_bd_intf_pins axi_interconnect/M03_AXI] [get_bd_intf_pins hdmi_output/S_AXI_CPU]
connect_bd_intf_net [get_bd_intf_ports TX_DDC] [get_bd_intf_pins hdmi_output/DDC]
connect_bd_intf_net -intf_net axi_interconnect_0_M00_AXI [get_bd_intf_pins axi_intc_0/s_axi] [get_bd_intf_pins interconnect_axilite/M00_AXI]
connect_bd_intf_net [get_bd_intf_pins axi_interconnect_0/M00_AXI] [get_bd_intf_pins ps_e/S_AXI_HPC0_FPD]
connect_bd_intf_net [get_bd_intf_pins axi_interconnect_1/M00_AXI] [get_bd_intf_pins ps_e/S_AXI_HP1_FPD]
connect_bd_intf_net [get_bd_intf_pins axi_interconnect/M00_AXI] [get_bd_intf_pins hdmi_output/s_axi_ctrl_mixer]
connect_bd_intf_net [get_bd_intf_pins axi_interconnect/M02_AXI] [get_bd_intf_pins hdmi_ctrl_iic/S_AXI]
connect_bd_intf_net [get_bd_intf_pins axi_interconnect_0/S01_AXI] [get_bd_intf_pins hdmi_output/m_axi_mm_video2]
connect_bd_intf_net [get_bd_intf_pins axi_interconnect_0/S02_AXI] [get_bd_intf_pins hdmi_output/m_axi_mm_video3]
connect_bd_intf_net [get_bd_intf_pins axi_interconnect_0/S03_AXI] [get_bd_intf_pins hdmi_output/m_axi_mm_video4]
connect_bd_intf_net [get_bd_intf_pins axi_interconnect_0/S04_AXI] [get_bd_intf_pins hdmi_output/m_axi_mm_video5]
connect_bd_intf_net [get_bd_intf_pins axi_interconnect_0/S05_AXI] [get_bd_intf_pins hdmi_output/m_axi_mm_video6]
connect_bd_intf_net [get_bd_intf_pins axi_interconnect_0/S06_AXI] [get_bd_intf_pins hdmi_output/m_axi_mm_video7]
connect_bd_intf_net [get_bd_intf_pins axi_interconnect_0/S07_AXI] [get_bd_intf_pins hdmi_output/m_axi_mm_video8]
connect_bd_intf_net [get_bd_intf_pins axi_interconnect_0/S08_AXI] [get_bd_intf_pins hdmi_output/m_axi_mm_video9]
connect_bd_intf_net [get_bd_intf_pins interconnect_axifull/M00_AXI] [get_bd_intf_pins ps_e/S_AXI_LPD]
connect_bd_intf_net -intf_net interconnect_axihpm0fpd_M01_AXI [get_bd_intf_pins axi_interconnect/M01_AXI] [get_bd_intf_pins vcu_0/S_AXI_LITE]
connect_bd_intf_net [get_bd_intf_pins axi_interconnect/S00_AXI] [get_bd_intf_pins ps_e/M_AXI_HPM0_FPD]
connect_bd_intf_net [get_bd_intf_pins interconnect_axilite/S00_AXI] [get_bd_intf_pins ps_e/M_AXI_HPM0_LPD]
connect_bd_intf_net -intf_net s_axi_ctrl_mixer_1 [get_bd_intf_pins axi_interconnect/M04_AXI] [get_bd_intf_pins hdmi_output/vid_phy_axi4lite_0]
connect_bd_intf_net [get_bd_intf_pins axi_interconnect_1/S01_AXI] [get_bd_intf_pins vcu_0/M_AXI_DEC0]
connect_bd_intf_net [get_bd_intf_pins axi_interconnect_1/S00_AXI] [get_bd_intf_pins vcu_0/M_AXI_DEC1]
connect_bd_intf_net [get_bd_intf_pins interconnect_axifull/S00_AXI] [get_bd_intf_pins vcu_0/M_AXI_MCU]
connect_bd_net -net LED0 [get_bd_pins hdmi_output/locked] [get_bd_ports LED0]
connect_bd_net [get_bd_pins ps_e/pl_resetn0] \
  [get_bd_pins clk_wiz_0/resetn] [get_bd_pins proc_sys_reset_0/ext_reset_in] [get_bd_pins proc_sys_reset_1/ext_reset_in] \
  [get_bd_pins proc_sys_reset_2/ext_reset_in] [get_bd_pins proc_sys_reset_3/ext_reset_in] \
  [get_bd_pins proc_sys_reset_4/ext_reset_in] [get_bd_pins proc_sys_reset_5/ext_reset_in] \
  [get_bd_pins proc_sys_reset_6/ext_reset_in] [get_bd_pins rst_ps_e_100M/ext_reset_in] [get_bd_pins vcu_0/vcu_resetn]
connect_bd_net [get_bd_ports SI5319_LOL] [get_bd_pins hdmi_output/SI5319_LOL]
connect_bd_net -net TX_EN_1 [get_bd_pins hdmi_output/TX_EN] [get_bd_ports TX_EN]
connect_bd_net [get_bd_ports TX_HPD] [get_bd_pins hdmi_output/hpd]
connect_bd_net [get_bd_ports TX_REFCLK_N] [get_bd_pins hdmi_output/TX_REFCLK_N]
connect_bd_net [get_bd_ports TX_REFCLK_P] [get_bd_pins hdmi_output/TX_REFCLK_P]
connect_bd_net -net aresetn_100M_1 [get_bd_pins proc_sys_reset_3/peripheral_aresetn] \
  [get_bd_pins axi_interconnect/M03_ARESETN] [get_bd_pins axi_interconnect/M04_ARESETN] \
  [get_bd_pins hdmi_output/aresetn_100M]
connect_bd_net [get_bd_pins axi_intc_0/irq] [get_bd_pins ps_e/pl_ps_irq0]
connect_bd_net [get_bd_pins clk_wiz_0/clk_out2] \
  [get_bd_pins axi_interconnect/ACLK] [get_bd_pins axi_interconnect/M00_ACLK] [get_bd_pins axi_interconnect/S00_ACLK] \
  [get_bd_pins axi_interconnect_0/ACLK] [get_bd_pins axi_interconnect_0/M00_ACLK] [get_bd_pins axi_interconnect_0/S00_ACLK] \
  [get_bd_pins axi_interconnect_0/S01_ACLK] [get_bd_pins axi_interconnect_0/S02_ACLK] \
  [get_bd_pins axi_interconnect_0/S03_ACLK] [get_bd_pins axi_interconnect_0/S04_ACLK] \
  [get_bd_pins axi_interconnect_0/S05_ACLK] [get_bd_pins axi_interconnect_0/S06_ACLK] \
  [get_bd_pins axi_interconnect_0/S07_ACLK] [get_bd_pins axi_interconnect_0/S08_ACLK] [get_bd_pins axi_interconnect_1/ACLK] \
  [get_bd_pins axi_interconnect_1/M00_ACLK] [get_bd_pins axi_interconnect_1/S00_ACLK] \
  [get_bd_pins axi_interconnect_1/S01_ACLK] [get_bd_pins hdmi_output/clk_300M] [get_bd_pins interconnect_axifull/ACLK] \
  [get_bd_pins interconnect_axifull/M00_ACLK] [get_bd_pins interconnect_axifull/S00_ACLK] \
  [get_bd_pins proc_sys_reset_1/slowest_sync_clk] [get_bd_pins ps_e/maxihpm0_fpd_aclk] [get_bd_pins ps_e/saxi_lpd_aclk] \
  [get_bd_pins ps_e/saxihp1_fpd_aclk] [get_bd_pins ps_e/saxihpc0_fpd_aclk] [get_bd_pins vcu_0/m_axi_dec_aclk] \
  [get_bd_pins vcu_0/m_axi_mcu_aclk]
connect_bd_net [get_bd_pins clk_wiz_0/clk_out3] \
  [get_bd_pins axi_intc_0/s_axi_aclk] [get_bd_pins axi_interconnect/M02_ACLK] [get_bd_pins hdmi_ctrl_iic/s_axi_aclk] \
  [get_bd_pins interconnect_axilite/ACLK] [get_bd_pins interconnect_axilite/M00_ACLK] \
  [get_bd_pins interconnect_axilite/S00_ACLK] [get_bd_pins proc_sys_reset_2/slowest_sync_clk] \
  [get_bd_pins ps_e/maxihpm0_lpd_aclk] [get_bd_pins vcu_0/pll_ref_clk]
connect_bd_net [get_bd_pins clk_wiz_0/clk_out1] [get_bd_pins proc_sys_reset_0/slowest_sync_clk]
connect_bd_net [get_bd_pins clk_wiz_0/clk_out4] \
  [get_bd_pins axi_interconnect/M03_ACLK] [get_bd_pins axi_interconnect/M04_ACLK] [get_bd_pins hdmi_output/clk_100M] \
  [get_bd_pins proc_sys_reset_3/slowest_sync_clk]
connect_bd_net [get_bd_pins clk_wiz_0/clk_out5] [get_bd_pins proc_sys_reset_4/slowest_sync_clk]
connect_bd_net [get_bd_pins clk_wiz_0/clk_out6] [get_bd_pins proc_sys_reset_5/slowest_sync_clk]
connect_bd_net [get_bd_pins clk_wiz_0/clk_out7] [get_bd_pins proc_sys_reset_6/slowest_sync_clk]
connect_bd_net [get_bd_pins clk_wiz_0/locked] \
  [get_bd_pins proc_sys_reset_0/dcm_locked] [get_bd_pins proc_sys_reset_1/dcm_locked] \
  [get_bd_pins proc_sys_reset_2/dcm_locked] [get_bd_pins proc_sys_reset_3/dcm_locked] \
  [get_bd_pins proc_sys_reset_4/dcm_locked] [get_bd_pins proc_sys_reset_5/dcm_locked] \
  [get_bd_pins proc_sys_reset_6/dcm_locked]
connect_bd_net -net gnd [get_bd_pins gnd_const/dout] [get_bd_ports LED3]
connect_bd_net -net gpio_1 [get_bd_pins gpio_aresetn/gpio_1] [get_bd_pins hdmi_output/mixer_aresetn]
connect_bd_net [get_bd_pins hdmi_ctrl_iic/iic2intc_irpt] [get_bd_pins xlconcat_0/In5]
connect_bd_net [get_bd_pins hdmi_output/HDMI_TX_CLK_N] [get_bd_ports HDMI_TX_CLK_N]
connect_bd_net [get_bd_pins hdmi_output/HDMI_TX_CLK_P] [get_bd_ports HDMI_TX_CLK_P]
connect_bd_net [get_bd_pins hdmi_output/HDMI_TX_DAT_N] [get_bd_ports HDMI_TX_DAT_N]
connect_bd_net [get_bd_pins hdmi_output/HDMI_TX_DAT_P] [get_bd_ports HDMI_TX_DAT_P]
connect_bd_net [get_bd_pins hdmi_output/LED1] [get_bd_ports LED1]
connect_bd_net [get_bd_pins hdmi_output/interrupt_hdmi_tx] [get_bd_pins xlconcat_0/In4]
connect_bd_net [get_bd_pins hdmi_output/interrupt_mixer] [get_bd_pins xlconcat_0/In7]
connect_bd_net [get_bd_pins hdmi_output/irq] [get_bd_pins xlconcat_0/In3]
connect_bd_net [get_bd_pins proc_sys_reset_1/interconnect_aresetn] \
  [get_bd_pins axi_interconnect/ARESETN] [get_bd_pins axi_interconnect/S00_ARESETN] [get_bd_pins axi_interconnect_1/ARESETN] \
  [get_bd_pins interconnect_axifull/ARESETN] [get_bd_pins interconnect_axifull/M00_ARESETN] \
  [get_bd_pins interconnect_axifull/S00_ARESETN]
connect_bd_net [get_bd_pins proc_sys_reset_1/mb_reset] [get_bd_pins axi_interconnect/M00_ARESETN]
connect_bd_net [get_bd_pins proc_sys_reset_1/peripheral_aresetn] \
  [get_bd_pins axi_interconnect_0/ARESETN] [get_bd_pins axi_interconnect_0/M00_ARESETN] \
  [get_bd_pins axi_interconnect_0/S00_ARESETN] [get_bd_pins axi_interconnect_0/S01_ARESETN] \
  [get_bd_pins axi_interconnect_0/S02_ARESETN] [get_bd_pins axi_interconnect_0/S03_ARESETN] \
  [get_bd_pins axi_interconnect_0/S04_ARESETN] [get_bd_pins axi_interconnect_0/S05_ARESETN] \
  [get_bd_pins axi_interconnect_0/S06_ARESETN] [get_bd_pins axi_interconnect_0/S07_ARESETN] \
  [get_bd_pins axi_interconnect_0/S08_ARESETN] [get_bd_pins axi_interconnect_1/M00_ARESETN] \
  [get_bd_pins axi_interconnect_1/S00_ARESETN] [get_bd_pins axi_interconnect_1/S01_ARESETN] \
  [get_bd_pins hdmi_output/aresetn_300M]
connect_bd_net [get_bd_pins proc_sys_reset_2/interconnect_aresetn] \
  [get_bd_pins axi_intc_0/s_axi_aresetn] [get_bd_pins axi_interconnect/M02_ARESETN] [get_bd_pins hdmi_ctrl_iic/s_axi_aresetn] \
  [get_bd_pins interconnect_axilite/ARESETN] [get_bd_pins interconnect_axilite/M00_ARESETN] \
  [get_bd_pins interconnect_axilite/S00_ARESETN]
connect_bd_net [get_bd_pins ps_e/emio_gpio_o] [get_bd_pins gpio_aresetn/Din]
connect_bd_net [get_bd_pins ps_e/pl_clk0] \
  [get_bd_pins axi_interconnect/M01_ACLK] [get_bd_pins clk_wiz_0/clk_in1] [get_bd_pins rst_ps_e_100M/slowest_sync_clk] \
  [get_bd_pins vcu_0/s_axi_lite_aclk]
connect_bd_net [get_bd_pins rst_ps_e_100M/peripheral_aresetn] [get_bd_ports SI5319_RST] [get_bd_pins axi_interconnect/M01_ARESETN]
connect_bd_net [get_bd_pins vcu_0/vcu_host_interrupt] [get_bd_pins xlconcat_0/In0]
connect_bd_net [get_bd_pins xlconcat_0/dout] [get_bd_pins ps_e/pl_ps_irq1]
set_property PFM.IRQ {intr {id 0 range 32}} [get_bd_cells axi_intc_0]
set_property HDL_ATTRIBUTE.DPA_TRACE_MASTER true [get_bd_cells axi_interconnect]
set_property PFM.AXI_PORT {S09_AXI {memport "S_AXI_HP" sptag "HPC0" memory "S_AXI_HPC0_FPD"} S10_AXI {memport "S_AXI_HP" sptag "HPC0" memory "S_AXI_HPC0_FPD"} S11_AXI {memport "S_AXI_HP" sptag "HPC0" memory "S_AXI_HPC0_FPD"} S12_AXI {memport "S_AXI_HP" sptag "HPC0" memory "S_AXI_HPC0_FPD"} S13_AXI {memport "S_AXI_HP" sptag "HPC0" memory "S_AXI_HPC0_FPD"} S14_AXI {memport "S_AXI_HP" sptag "HPC0" memory "S_AXI_HPC0_FPD"} S15_AXI {memport "S_AXI_HP" sptag "HPC0" memory "S_AXI_HPC0_FPD"}} [get_bd_cells axi_interconnect_0]
set_property PFM.CLOCK {clk_out1 {id "0" is_default "false" proc_sys_reset "proc_sys_reset_0" status "fixed"} clk_out2 {id "1" is_default "true" proc_sys_reset "proc_sys_reset_1" status "fixed"} clk_out3 {id "2" is_default "false" proc_sys_reset "/proc_sys_reset_2" status "fixed"} clk_out4 {id "3" is_default "false" proc_sys_reset "/proc_sys_reset_3" status "fixed"} clk_out5 {id "4" is_default "false" proc_sys_reset "/proc_sys_reset_4" status "fixed"} clk_out6 {id "5" is_default "false" proc_sys_reset "/proc_sys_reset_5" status "fixed"} clk_out7 {id "6" is_default "false" proc_sys_reset "/proc_sys_reset_6" status "fixed"}} [get_bd_cells clk_wiz_0]
set_property HDL_ATTRIBUTE.DPA_TRACE_SLAVE true [get_bd_cells interconnect_axifull]
set_property PFM.AXI_PORT {S01_AXI {memport "S_AXI_HP" sptag "LPD" memory "ps_e LPD_DDR_LOW"} S02_AXI {memport "S_AXI_HP" sptag "LPD" memory "ps_e LPD_DDR_LOW"} S03_AXI {memport "S_AXI_HP" sptag "LPD" memory "ps_e LPD_DDR_LOW"} S04_AXI {memport "S_AXI_HP" sptag "LPD" memory "ps_e LPD_DDR_LOW"} S05_AXI {memport "S_AXI_HP" sptag "LPD" memory "ps_e LPD_DDR_LOW"} S06_AXI {memport "S_AXI_HP" sptag "LPD" memory "ps_e LPD_DDR_LOW"} S07_AXI {memport "S_AXI_HP" sptag "LPD" memory "ps_e LPD_DDR_LOW"} S08_AXI {memport "S_AXI_HP" sptag "LPD" memory "ps_e LPD_DDR_LOW"} S09_AXI {memport "S_AXI_HP" sptag "LPD" memory "ps_e LPD_DDR_LOW"} S10_AXI {memport "S_AXI_HP" sptag "LPD" memory "ps_e LPD_DDR_LOW"} S11_AXI {memport "S_AXI_HP" sptag "LPD" memory "ps_e LPD_DDR_LOW"} S12_AXI {memport "S_AXI_HP" sptag "LPD" memory "ps_e LPD_DDR_LOW"} S13_AXI {memport "S_AXI_HP" sptag "LPD" memory "ps_e LPD_DDR_LOW"} S14_AXI {memport "S_AXI_HP" sptag "LPD" memory "ps_e LPD_DDR_LOW"} S15_AXI {memport "S_AXI_HP" sptag "LPD" memory "ps_e LPD_DDR_LOW"}} [get_bd_cells interconnect_axifull]
set_property HDL_ATTRIBUTE.DPA_AXILITE_MASTER fallback [get_bd_cells interconnect_axilite]
set_property PFM.AXI_PORT {M01_AXI {memport "M_AXI_GP"} M02_AXI {memport "M_AXI_GP"} M03_AXI {memport "M_AXI_GP"} M04_AXI {memport "M_AXI_GP"} M05_AXI {memport "M_AXI_GP"} M06_AXI {memport "M_AXI_GP"} M07_AXI {memport "M_AXI_GP"} M08_AXI {memport "M_AXI_GP"} M09_AXI {memport "M_AXI_GP"} M10_AXI {memport "M_AXI_GP"} M11_AXI {memport "M_AXI_GP"} M12_AXI {memport "M_AXI_GP"} M13_AXI {memport "M_AXI_GP"} M14_AXI {memport "M_AXI_GP"} M15_AXI {memport "M_AXI_GP"} M16_AXI {memport "M_AXI_GP"} M17_AXI {memport "M_AXI_GP"} M18_AXI {memport "M_AXI_GP"} M19_AXI {memport "M_AXI_GP"} M20_AXI {memport "M_AXI_GP"} M21_AXI {memport "M_AXI_GP"} M22_AXI {memport "M_AXI_GP"} M23_AXI {memport "M_AXI_GP"} M24_AXI {memport "M_AXI_GP"} M25_AXI {memport "M_AXI_GP"} M26_AXI {memport "M_AXI_GP"} M27_AXI {memport "M_AXI_GP"} M28_AXI {memport "M_AXI_GP"} M29_AXI {memport "M_AXI_GP"} M30_AXI {memport "M_AXI_GP"} M31_AXI {memport "M_AXI_GP"} M32_AXI {memport "M_AXI_GP"} M33_AXI {memport "M_AXI_GP"} M34_AXI {memport "M_AXI_GP"} M35_AXI {memport "M_AXI_GP"} M36_AXI {memport "M_AXI_GP"} M37_AXI {memport "M_AXI_GP"} M38_AXI {memport "M_AXI_GP"} M39_AXI {memport "M_AXI_GP"} M40_AXI {memport "M_AXI_GP"} M41_AXI {memport "M_AXI_GP"} M42_AXI {memport "M_AXI_GP"} M43_AXI {memport "M_AXI_GP"} M44_AXI {memport "M_AXI_GP"} M45_AXI {memport "M_AXI_GP"} M46_AXI {memport "M_AXI_GP"} M47_AXI {memport "M_AXI_GP"} M48_AXI {memport "M_AXI_GP"} M49_AXI {memport "M_AXI_GP"} M50_AXI {memport "M_AXI_GP"} M51_AXI {memport "M_AXI_GP"} M52_AXI {memport "M_AXI_GP"} M53_AXI {memport "M_AXI_GP"} M54_AXI {memport "M_AXI_GP"} M55_AXI {memport "M_AXI_GP"} M56_AXI {memport "M_AXI_GP"} M57_AXI {memport "M_AXI_GP"} M58_AXI {memport "M_AXI_GP"} M59_AXI {memport "M_AXI_GP"} M60_AXI {memport "M_AXI_GP"} M61_AXI {memport "M_AXI_GP"} M62_AXI {memport "M_AXI_GP"} M63_AXI {memport "M_AXI_GP"}} [get_bd_cells interconnect_axilite]
set_property PFM.AXI_PORT {M_AXI_HPM1_FPD {memport "M_AXI_GP" sptag "" memory ""} S_AXI_HPC1_FPD {memport "S_AXI_HP" sptag "HPC1" memory "ps_e HPC1_DDR_LOW"} S_AXI_HP0_FPD {memport "S_AXI_HP" sptag "HP0" memory "ps_e HP0_DDR_LOW"} S_AXI_HP2_FPD {memport "S_AXI_HP" sptag "HP2" memory "ps_e HP2_DDR_LOW"} S_AXI_HP3_FPD {memport "S_AXI_HP" sptag "HP3" memory "ps_e HP3_DDR_LOW"}} [get_bd_cells ps_e]

# ---- address map ----
assign_bd_address -offset 0x00000000 -range 2G -target_address_space [get_bd_addr_spaces hdmi_output/v_mix_0/Data_m_axi_mm_video1] [get_bd_addr_segs ps_e/SAXIGP0/HPC0_DDR_LOW]
assign_bd_address -offset 0xC0000000 -range 512M -target_address_space [get_bd_addr_spaces hdmi_output/v_mix_0/Data_m_axi_mm_video1] [get_bd_addr_segs ps_e/SAXIGP0/HPC0_QSPI]
exclude_bd_addr_seg -offset 0xFF000000 -range 16M -target_address_space [get_bd_addr_spaces hdmi_output/v_mix_0/Data_m_axi_mm_video1] [get_bd_addr_segs ps_e/SAXIGP0/HPC0_LPS_OCM]
assign_bd_address -offset 0x00000000 -range 2G -target_address_space [get_bd_addr_spaces hdmi_output/v_mix_0/Data_m_axi_mm_video2] [get_bd_addr_segs ps_e/SAXIGP0/HPC0_DDR_LOW]
assign_bd_address -offset 0xC0000000 -range 512M -target_address_space [get_bd_addr_spaces hdmi_output/v_mix_0/Data_m_axi_mm_video2] [get_bd_addr_segs ps_e/SAXIGP0/HPC0_QSPI]
exclude_bd_addr_seg -offset 0xFF000000 -range 16M -target_address_space [get_bd_addr_spaces hdmi_output/v_mix_0/Data_m_axi_mm_video2] [get_bd_addr_segs ps_e/SAXIGP0/HPC0_LPS_OCM]
assign_bd_address -offset 0x00000000 -range 2G -target_address_space [get_bd_addr_spaces hdmi_output/v_mix_0/Data_m_axi_mm_video3] [get_bd_addr_segs ps_e/SAXIGP0/HPC0_DDR_LOW]
assign_bd_address -offset 0xC0000000 -range 512M -target_address_space [get_bd_addr_spaces hdmi_output/v_mix_0/Data_m_axi_mm_video3] [get_bd_addr_segs ps_e/SAXIGP0/HPC0_QSPI]
exclude_bd_addr_seg -offset 0xFF000000 -range 16M -target_address_space [get_bd_addr_spaces hdmi_output/v_mix_0/Data_m_axi_mm_video3] [get_bd_addr_segs ps_e/SAXIGP0/HPC0_LPS_OCM]
assign_bd_address -offset 0x00000000 -range 2G -target_address_space [get_bd_addr_spaces hdmi_output/v_mix_0/Data_m_axi_mm_video4] [get_bd_addr_segs ps_e/SAXIGP0/HPC0_DDR_LOW]
assign_bd_address -offset 0xC0000000 -range 512M -target_address_space [get_bd_addr_spaces hdmi_output/v_mix_0/Data_m_axi_mm_video4] [get_bd_addr_segs ps_e/SAXIGP0/HPC0_QSPI]
exclude_bd_addr_seg -offset 0xFF000000 -range 16M -target_address_space [get_bd_addr_spaces hdmi_output/v_mix_0/Data_m_axi_mm_video4] [get_bd_addr_segs ps_e/SAXIGP0/HPC0_LPS_OCM]
assign_bd_address -offset 0x00000000 -range 2G -target_address_space [get_bd_addr_spaces hdmi_output/v_mix_0/Data_m_axi_mm_video5] [get_bd_addr_segs ps_e/SAXIGP0/HPC0_DDR_LOW]
assign_bd_address -offset 0xC0000000 -range 512M -target_address_space [get_bd_addr_spaces hdmi_output/v_mix_0/Data_m_axi_mm_video5] [get_bd_addr_segs ps_e/SAXIGP0/HPC0_QSPI]
exclude_bd_addr_seg -offset 0xFF000000 -range 16M -target_address_space [get_bd_addr_spaces hdmi_output/v_mix_0/Data_m_axi_mm_video5] [get_bd_addr_segs ps_e/SAXIGP0/HPC0_LPS_OCM]
assign_bd_address -offset 0x00000000 -range 2G -target_address_space [get_bd_addr_spaces hdmi_output/v_mix_0/Data_m_axi_mm_video6] [get_bd_addr_segs ps_e/SAXIGP0/HPC0_DDR_LOW]
assign_bd_address -offset 0xC0000000 -range 512M -target_address_space [get_bd_addr_spaces hdmi_output/v_mix_0/Data_m_axi_mm_video6] [get_bd_addr_segs ps_e/SAXIGP0/HPC0_QSPI]
exclude_bd_addr_seg -offset 0xFF000000 -range 16M -target_address_space [get_bd_addr_spaces hdmi_output/v_mix_0/Data_m_axi_mm_video6] [get_bd_addr_segs ps_e/SAXIGP0/HPC0_LPS_OCM]
assign_bd_address -offset 0x00000000 -range 2G -target_address_space [get_bd_addr_spaces hdmi_output/v_mix_0/Data_m_axi_mm_video7] [get_bd_addr_segs ps_e/SAXIGP0/HPC0_DDR_LOW]
assign_bd_address -offset 0xC0000000 -range 512M -target_address_space [get_bd_addr_spaces hdmi_output/v_mix_0/Data_m_axi_mm_video7] [get_bd_addr_segs ps_e/SAXIGP0/HPC0_QSPI]
exclude_bd_addr_seg -offset 0xFF000000 -range 16M -target_address_space [get_bd_addr_spaces hdmi_output/v_mix_0/Data_m_axi_mm_video7] [get_bd_addr_segs ps_e/SAXIGP0/HPC0_LPS_OCM]
assign_bd_address -offset 0x00000000 -range 2G -target_address_space [get_bd_addr_spaces hdmi_output/v_mix_0/Data_m_axi_mm_video8] [get_bd_addr_segs ps_e/SAXIGP0/HPC0_DDR_LOW]
assign_bd_address -offset 0xC0000000 -range 512M -target_address_space [get_bd_addr_spaces hdmi_output/v_mix_0/Data_m_axi_mm_video8] [get_bd_addr_segs ps_e/SAXIGP0/HPC0_QSPI]
exclude_bd_addr_seg -offset 0xFF000000 -range 16M -target_address_space [get_bd_addr_spaces hdmi_output/v_mix_0/Data_m_axi_mm_video8] [get_bd_addr_segs ps_e/SAXIGP0/HPC0_LPS_OCM]
assign_bd_address -offset 0x00000000 -range 2G -target_address_space [get_bd_addr_spaces hdmi_output/v_mix_0/Data_m_axi_mm_video9] [get_bd_addr_segs ps_e/SAXIGP0/HPC0_DDR_LOW]
assign_bd_address -offset 0xC0000000 -range 512M -target_address_space [get_bd_addr_spaces hdmi_output/v_mix_0/Data_m_axi_mm_video9] [get_bd_addr_segs ps_e/SAXIGP0/HPC0_QSPI]
exclude_bd_addr_seg -offset 0xFF000000 -range 16M -target_address_space [get_bd_addr_spaces hdmi_output/v_mix_0/Data_m_axi_mm_video9] [get_bd_addr_segs ps_e/SAXIGP0/HPC0_LPS_OCM]
assign_bd_address -offset 0x0080020000 -range 4K -target_address_space [get_bd_addr_spaces ps_e/Data] [get_bd_addr_segs axi_intc_0/S_AXI/Reg]
assign_bd_address -offset 0x00A0000000 -range 1M -target_address_space [get_bd_addr_spaces ps_e/Data] [get_bd_addr_segs vcu_0/S_AXI_LITE/Reg]
assign_bd_address -offset 0x00A0100000 -range 128K -target_address_space [get_bd_addr_spaces ps_e/Data] [get_bd_addr_segs hdmi_output/v_hdmi_tx_ss_0/S_AXI_CPU_IN/Reg]
assign_bd_address -offset 0x00A0120000 -range 64K -target_address_space [get_bd_addr_spaces ps_e/Data] [get_bd_addr_segs hdmi_ctrl_iic/S_AXI/Reg]
assign_bd_address -offset 0x00A0130000 -range 64K -target_address_space [get_bd_addr_spaces ps_e/Data] [get_bd_addr_segs hdmi_output/v_mix_0/s_axi_CTRL/Reg]
assign_bd_address -offset 0x00A0140000 -range 64K -target_address_space [get_bd_addr_spaces ps_e/Data] [get_bd_addr_segs hdmi_output/vid_phy_controller/vid_phy_axi4lite/Reg]
assign_bd_address -offset 0x00000000000 -range 2G -target_address_space [get_bd_addr_spaces vcu_0/Code] [get_bd_addr_segs ps_e/SAXIGP6/LPD_DDR_LOW]
assign_bd_address -offset 0x000C0000000 -range 512M -target_address_space [get_bd_addr_spaces vcu_0/Code] [get_bd_addr_segs ps_e/SAXIGP6/LPD_QSPI]
assign_bd_address -offset 0x000FF000000 -range 16M -target_address_space [get_bd_addr_spaces vcu_0/Code] [get_bd_addr_segs ps_e/SAXIGP6/LPD_LPS_OCM]
assign_bd_address -offset 0x00000000000 -range 2G -target_address_space [get_bd_addr_spaces vcu_0/DecData0] [get_bd_addr_segs ps_e/SAXIGP3/HP1_DDR_LOW]
assign_bd_address -offset 0x000C0000000 -range 512M -target_address_space [get_bd_addr_spaces vcu_0/DecData0] [get_bd_addr_segs ps_e/SAXIGP3/HP1_QSPI]
assign_bd_address -offset 0x000FF000000 -range 16M -target_address_space [get_bd_addr_spaces vcu_0/DecData0] [get_bd_addr_segs ps_e/SAXIGP3/HP1_LPS_OCM]
assign_bd_address -offset 0x00000000000 -range 2G -target_address_space [get_bd_addr_spaces vcu_0/DecData1] [get_bd_addr_segs ps_e/SAXIGP3/HP1_DDR_LOW]
assign_bd_address -offset 0x000C0000000 -range 512M -target_address_space [get_bd_addr_spaces vcu_0/DecData1] [get_bd_addr_segs ps_e/SAXIGP3/HP1_QSPI]
assign_bd_address -offset 0x000FF000000 -range 16M -target_address_space [get_bd_addr_spaces vcu_0/DecData1] [get_bd_addr_segs ps_e/SAXIGP3/HP1_LPS_OCM]

validate_bd_design
save_bd_design
